# EAGLE design switching_unit (EAGLE 8.2.0)
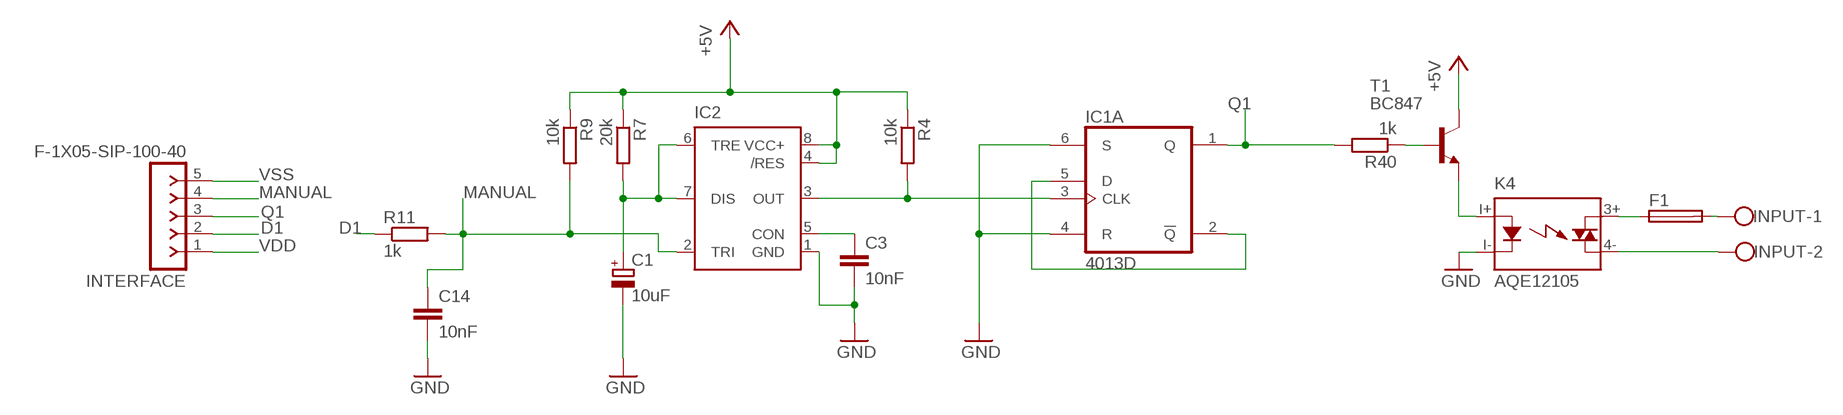
[diagram p0: schematic, sheet 1]

## Parts
C1  10uF  CPOL-EU153CLV-0405  [153CLV-0405]
C3  10nF  C-EUC1206  [C1206]
C14  10nF  C-EUC1206  [C1206]
F1  SH22,5A  [SH22,5A]
IC1  4013D  [SO14]
IC2  NE555D  [SO08]
INPUT  W237-102  [W237-102]
INTERFACE  F-1X05-SIP-100-40  [SIP-100-05-40]
K4  AQE12105  [AQE]
R4  10k  R-EU_R1206  [R1206]
R7  20k  R-EU_R1206  [R1206]
R9  10k  R-EU_R1206  [R1206]
R11  1k  R-EU_R1206  [R1206]
R40  1k  R-EU_R1206  [R1206]
T1  BC847  [SOT23]

## Nets
D1: INTERFACE.2 R11.1
MANUAL: C14.1 IC2.2(TRI) INTERFACE.4 R9.2 R11.2
N$1: R40.1 T1.1(B)
N$2: INPUT.2 K4.4-(DS2)
N$3: F1.2 INPUT.1
N$4: K4.I+(A) T1.2(E)
N$8: IC1.2(A:!Q) IC1.5(A:D)
N$14: IC1.3(A:CLK) IC2.3(OUT) R4.2
N$15: C1.+ IC2.6(TRE) IC2.7(DIS) R7.2
N$18: C3.1 IC2.5(CON)
N$52: F1.1 K4.3+(DS1)
Q1: IC1.1(A:Q) INTERFACE.3 R40.2
VDD: IC2.4(/RES) IC2.8(VCC+) INTERFACE.1 R4.1 R7.1 R9.1 T1.3(C) ; supply symbol labelled +5V
VSS: C1.- C3.2 C14.2 IC1.4(A:R) IC1.6(A:S) IC2.1(GND) INTERFACE.5 K4.I-(K) ; supply symbol labelled GND
Unconnected: IC1.8(B:S) IC1.9(B:D) IC1.10(B:R) IC1.11(B:CLK) IC1.12(B:!Q) IC1.13(B:Q)

## Power pins joined to a net without a drawn wire
VDD: IC1.14(P:VDD)
VSS: IC1.7(P:VSS)

## Library data of the parts
C1 = resistor:CPOL-EU: POLARIZED CAPACITOR, European symbol
C3 C14 = rcl:C-EU: CAPACITOR, European symbol
F1 = fuse (2):SH22,5A: FUSE HOLDER grid 22,5mm, isolated cap OGN0031 8201, Schurter (Buerklin)
IC1 = 40xx:4013: Dual D FLIP FLOP, set/reset
IC2 = SparkFun-AnalogIC:NE555: General purpose bipolar Timer
INPUT = con-wago-500:W237-102: WAGO SCREW CLAMP; MPN: 237-102; OC_FARNELL: unknown; OC_NEWARK: 70K9898
INTERFACE = con-headers-jp:F-1X05-: FEMALE HEADER
K4 = relay_old:AQE*: SOLID STATE RELAY NAiS Source: http://www.mew-europe.com/.. en_ds_61610_0000.pdf; OC_FARNELL: unknown; OC_NEWARK: unknown
R4 R7 R9 R11 R40 = rcl:R-EU_: RESISTOR, European symbol
T1 = transistor-neu-to92:BC847: NPN TRANSISTOR

## Board
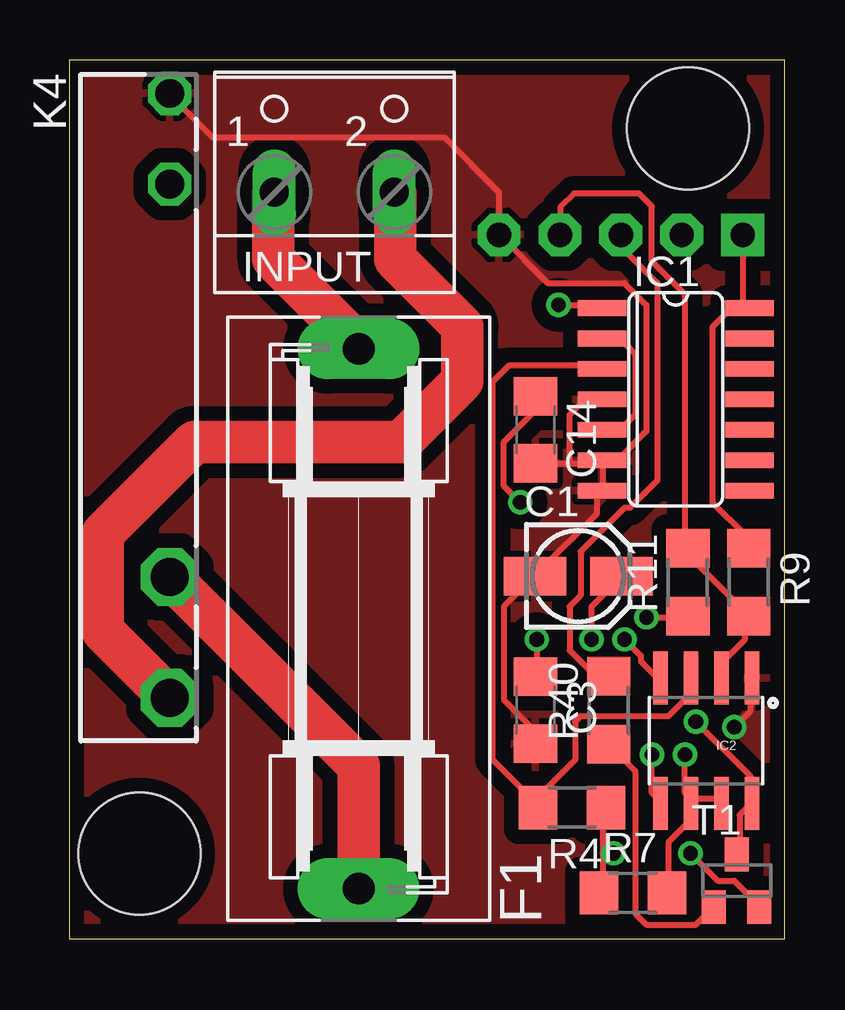
[diagram p1: board, top side]
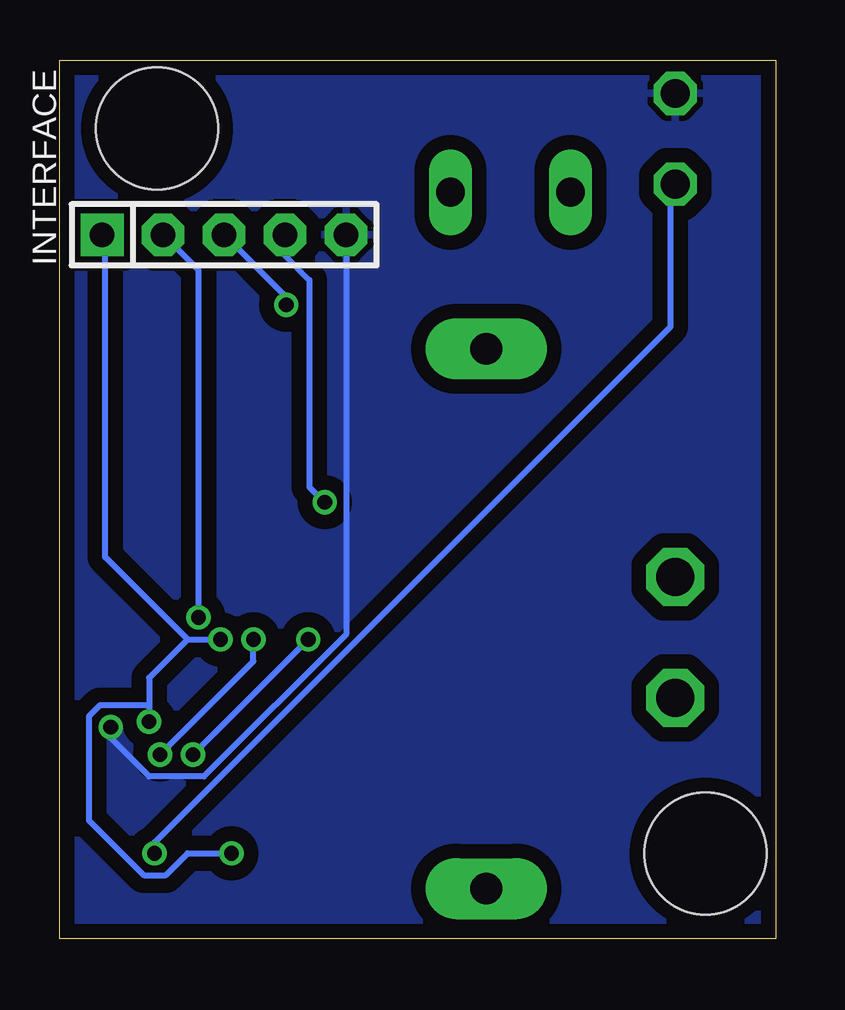
[diagram p2: board, bottom side, seen from below]

Size 29.83 x 36.63 mm. Coordinates in mm from the lower left corner, seen from the top.
Outline: 0,0 29.83,0 29.83,36.63 0,36.63 0,0
Copper layers (1*16): Top 0.035mm / dielectric 1.5mm / Bottom 0.035mm
Design rules "default *": minimum track width 10mil, minimum drill 24mil, track to track 8mil, track to pad 8mil, pad to pad 8mil, via to via 8mil, smd to smd 8mil, copper to edge 8mil, drill to drill 8mil, minimum pad ring 10mil, minimum via ring 8mil, stop-mask expansion 4mil, vias tented up to drill 0mil, thermal gap 10mil
Holes 5.08 mm at 25.79,33.77 2.93,3.54

### Footprints (pad centres in the part's own frame; a part is rotated, then mirrored left to right if it is on the bottom)
153CLV-0405 = smd 2.6 x 1.6: + 1.8,0; - -1.8,0
C1206 = smd 1.6 x 1.8: 1 -1.4,0; 2 1.4,0
SH22,5A = drill 1.321 pad 2.54 long: 1 -11.252,0; 2 11.252,0
SO14 = smd 0.66 x 2.032: 1 -3.81,-3.073; 2 -2.54,-3.073; 3 -1.27,-3.073; 4 0,-3.073; 5 1.27,-3.073; 6 2.54,-3.073; 7 3.81,-3.073; 8 3.81,3.073; 9 2.54,3.073; 10 1.27,3.073; 11 0,3.073; 12 -1.27,3.073; 13 -2.54,3.073; 14 -3.81,3.073
SO08 = smd 0.61 x 2.21: 1 -1.905,-2.616; 2 -0.635,-2.616; 3 0.635,-2.616; 4 1.905,-2.616; 5 1.905,2.616; 6 0.635,2.616; 7 -0.635,2.616; 8 -1.905,2.616
W237-102 = drill 1.194 long: 1 -2.5,-1.27; 2 2.5,-1.27
SIP-100-05-40 = drill 1.016 pad 1.778 square: 1 -5.08,0 | drill 1.016 pad 1.778 octagon: 2 -2.54,0; 3 0,0; 4 2.54,0; 5 5.08,0
AQE = drill 1.6 octagon: 3+ 7.66,1.27; 4- 12.7,1.27 | drill 1.2 octagon: I+ -8.72,1.27; I- -12.5,1.27
R1206 = smd 1.6 x 1.803: 1 -1.422,0; 2 1.422,0
SOT23 = smd 1 x 1.4: 1 -0.95,-1.1; 2 0.95,-1.1; 3 0,1.1

### Placement (x,y rotation side)
C1  21.21,15.11 0 top
C3  19.43,9.52 270 top
C14  19.43,21.21 270 top
F1  12.06,13.33 90 top
IC1  25.27,22.48 270 top
IC2  26.54,8.25 180 top
INPUT  11.05,32.38 0 top
INTERFACE  22.99,29.34 0 bottom
K4  2.92,22.73 270 top
R4  20.96,5.46 180 top
R7  23.5,1.91 0 top
R9  28.32,14.86 270 top
R11  25.78,14.86 90 top
R40  22.48,9.52 90 top
T1  27.81,2.41 0 top

### Tracks (layer width: path | path; a pad name or v marks a point on that pad's centre or on a via)
D1  (via drill 0.61)
  Top 0.254: v24.05,13.39 25.65,13.39 R11.1
  Bottom 0.254: INTERFACE.2 24.05,27.86 v24.05,13.39
MANUAL  (via drill 0.61)
  Top 0.254: IC2.2 27.25,10.87 27.25,11.56 28.17,12.47 28.17,13.39 R9.2 28.17,13.61 25.65,16.13 R11.2 25.65,16.36 25.65,26.87 24.28,28.25 24.28,30.53 23.75,31.06 21.03,31.06 20.47,30.51 20.47,29.36 INTERFACE.4 | v18.8,18.19 18.11,18.87 18.11,20.7 19.25,21.84 19.25,22.53 C14.1
  Bottom 0.254: INTERFACE.4 20.45,28.47 19.43,27.46 19.43,18.82 v18.8,18.19
N$1
  Top 0.254: T1.1 26.8,1.27 26.11,0.58 24.05,0.58 23.6,1.04 23.6,6.99 22.68,7.9 R40.1
N$2
  Top 1.778: K4.4- 1.4,12.83 1.4,16.89 5.21,20.7 13.84,20.7 16.38,23.24 16.38,25.53 13.59,28.32 13.59,31.08 INPUT.2
N$3
  Top 1.778: F1.2 12.06,24.77 8.51,28.32 8.51,31.08 INPUT.1
N$4  (via drill 0.61)
  Top 0.254: v25.88,3.56 27.03,2.41 27.71,2.41 28.63,1.5 T1.2
  Bottom 0.254: v25.88,3.56 25.88,4.01 4.39,25.5 4.39,31.45 K4.I+
N$8
  Top 0.254: IC1.5 22.23,21.39 23.14,21.39 23.6,21.84 23.6,24.36 23.14,24.82 22.23,24.82 IC1.2
N$14
  Top 0.254: IC2.3 25.88,10.87 25.88,10.18 24.97,9.27 21.31,9.27 21.08,9.04 21.08,7.44 19.71,6.07 19.71,5.61 R4.2 19.48,5.61 17.65,7.44 17.65,23.22 18.34,23.9 22,23.9 IC1.3
N$15  (via drill 0.61)
  Top 0.254: R7.2 24.97,1.96 24.97,4.01 25.88,4.93 25.88,5.61 IC2.6 | IC2.7 27.03,5.84 26.11,5.84 IC2.6 | v21.77,12.47 21.77,13.84 22.91,14.99 C1.+ | v25.65,7.67 25.65,6.07 25.88,5.84 IC2.6
  Bottom 0.254: v21.77,12.47 21.77,11.56 v25.65,7.67
N$18  (via drill 0.61)
  Top 0.254: v19.48,12.47 19.48,11.1 C3.1 | v24.28,7.67 24.28,6.07 24.51,5.84 IC2.5
  Bottom 0.254: v24.28,7.67 v19.48,12.47
N$52
  Top 1.778: F1.1 12.06,7.2 K4.3+
Q1  (via drill 0.61)
  Top 0.254: R40.2 22.45,11.1 21.77,11.1 20.85,12.01 20.85,13.84 21.31,14.3 21.31,16.13 23.14,17.96 23.37,17.96 24.51,19.1 24.51,27.33 22.99,28.85 INTERFACE.3 | v20.4,26.42 22,26.42 IC1.1
  Bottom 0.254: v20.4,26.42 20.4,26.75 INTERFACE.3
VDD  (via drill 0.61)
  Top 0.254: T1.3 27.94,3.56 27.94,5.16 28.4,5.61 IC2.8 28.4,5.84 28.4,6.76 v26.11,9.04 | R9.1 28.17,16.36 28.17,16.82 26.8,18.19 26.8,25.5 27.48,26.19 28.17,26.19 IC1.14 28.17,26.42 28.07,26.52 INTERFACE.1 | 22.23,3.56 22.23,5.38 R4.1 | 22.23,3.56 22.23,1.96 R7.1 | v23.14,12.47 23.83,11.79 23.83,11.56 24.51,10.87 IC2.4 | v22.68,3.56 22.23,3.56
  Bottom 0.254: 24.51,12.47 v23.14,12.47 | 24.51,12.47 27.94,15.9 27.94,29.21 INTERFACE.1 | 26.11,9.73 26.11,10.87 24.51,12.47 | 26.11,9.73 v26.11,9.04 | v22.68,3.56 24.51,3.56 25.43,2.64 26.34,2.64 28.63,4.93 28.63,9.27 28.17,9.73 26.11,9.73
VSS  (via drill 0.61)
  Top 0.254: IC1.6 22.23,19.79 22.23,18.87 IC1.7 22,18.64 22,17.73 19.48,15.21 C1.- 19.25,14.99 18.11,13.84 18.11,9.96 19.25,8.81 19.25,8.13 C3.2 | 20.85,19.79 22,19.79 IC1.6 | 20.85,19.79 19.48,19.79 C14.2 | 20.85,19.79 20.85,21.84 21.31,22.3 22,22.3 IC1.4 | v27.71,8.81 28.4,9.5 28.4,10.87 IC2.1 | IC1.6 22.23,20.02 22.91,20.02 24.05,21.16 24.05,26.42 23.14,27.33 19.94,27.33 17.93,29.34 INTERFACE.5 17.91,31.12 15.62,33.4 5.97,33.4 4.39,34.98 4.39,35.1 K4.I-
  Bottom 0.254: v27.71,8.81 27.71,8.36 26.11,6.76 23.83,6.76 17.88,12.7 17.88,29.31 INTERFACE.5
  pour Top (isolate 0.61): 0.13,36.45 0.13,0.13 29.85,0.13 29.85,36.45
  pour Bottom (isolate 0.61): 0.13,36.45 0.13,0.13 29.85,0.13 29.85,36.45